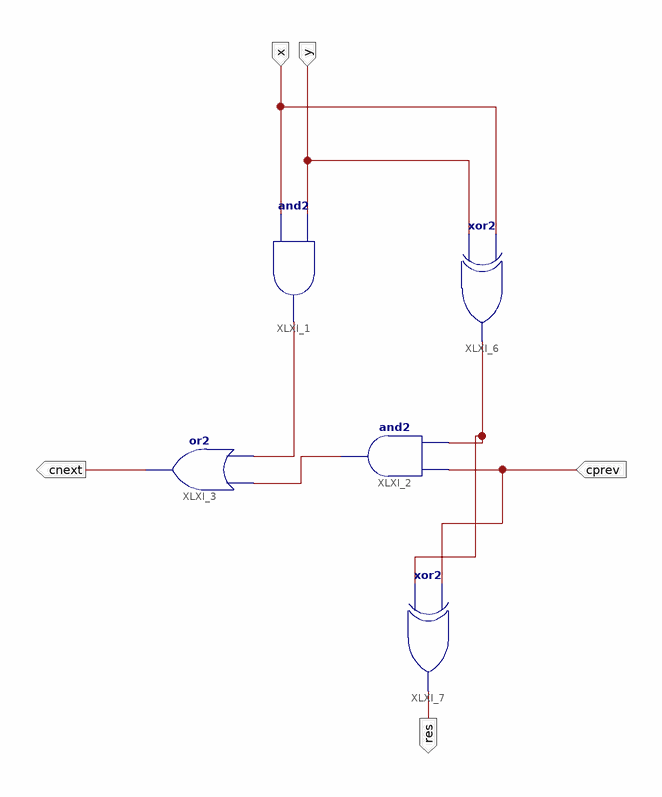
[diagram p0: schematic sheet 1]
// Xilinx ISE schematic fa_sch.sch (artix7) as structural Verilog: 5 symbols, 5 ports
module fa_sch (
  input  y,
  input  x,
  input  cprev,
  output cnext,
  output res
);

  wire XLXN_7, XLXN_15, XLXN_16;

  and XLXI_1 (XLXN_7, x, y);
  and XLXI_2 (XLXN_16, XLXN_15, cprev);
  or XLXI_3 (cnext, XLXN_7, XLXN_16);
  xor XLXI_6 (XLXN_15, y, x);
  xor XLXI_7 (res, XLXN_15, cprev);
endmodule
